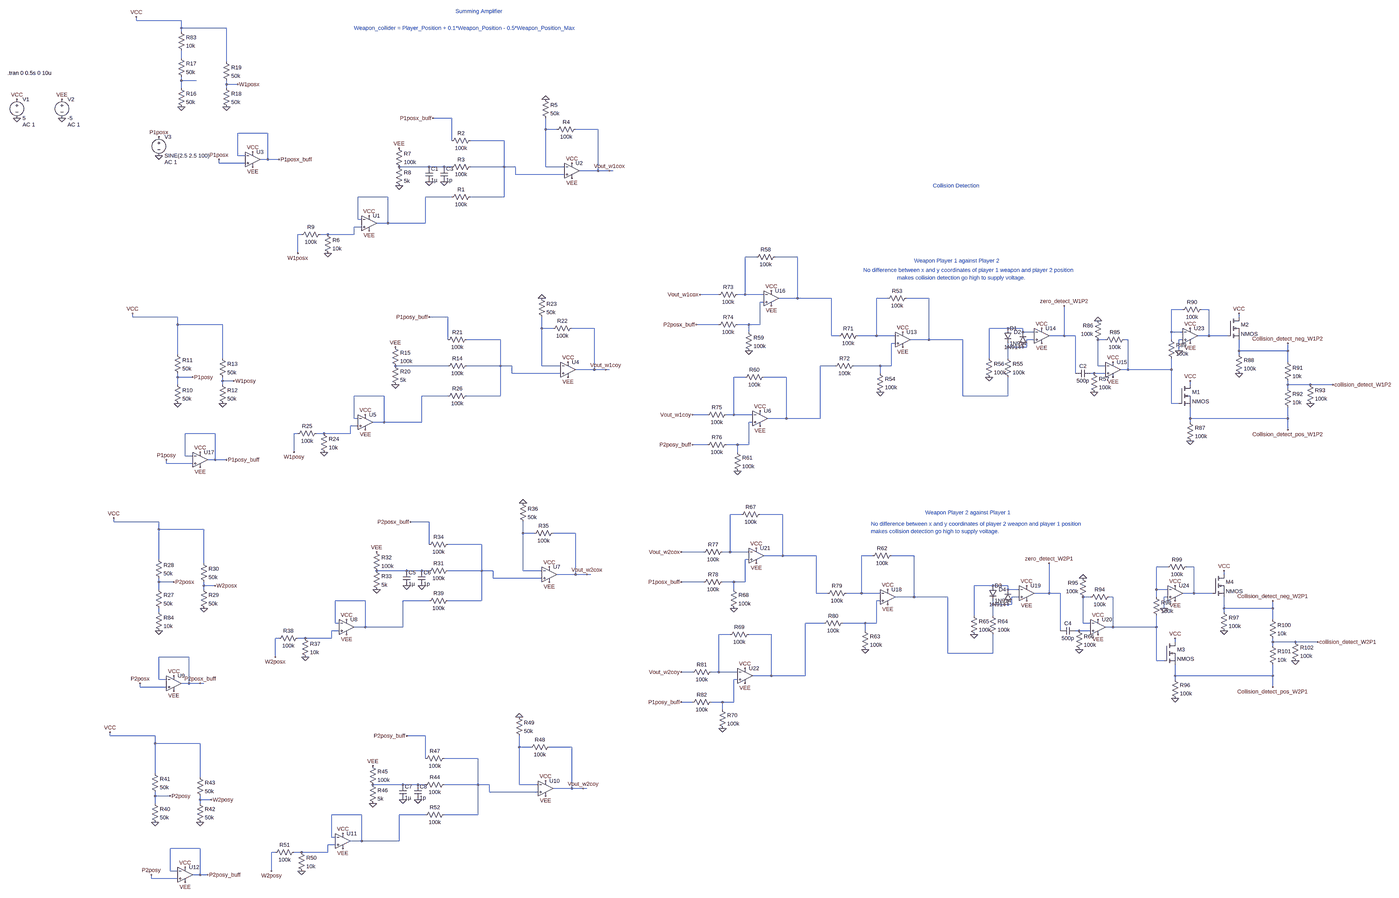
[diagram p0: schematic analog-vg-circuit-stabber.asc, whole sheet]
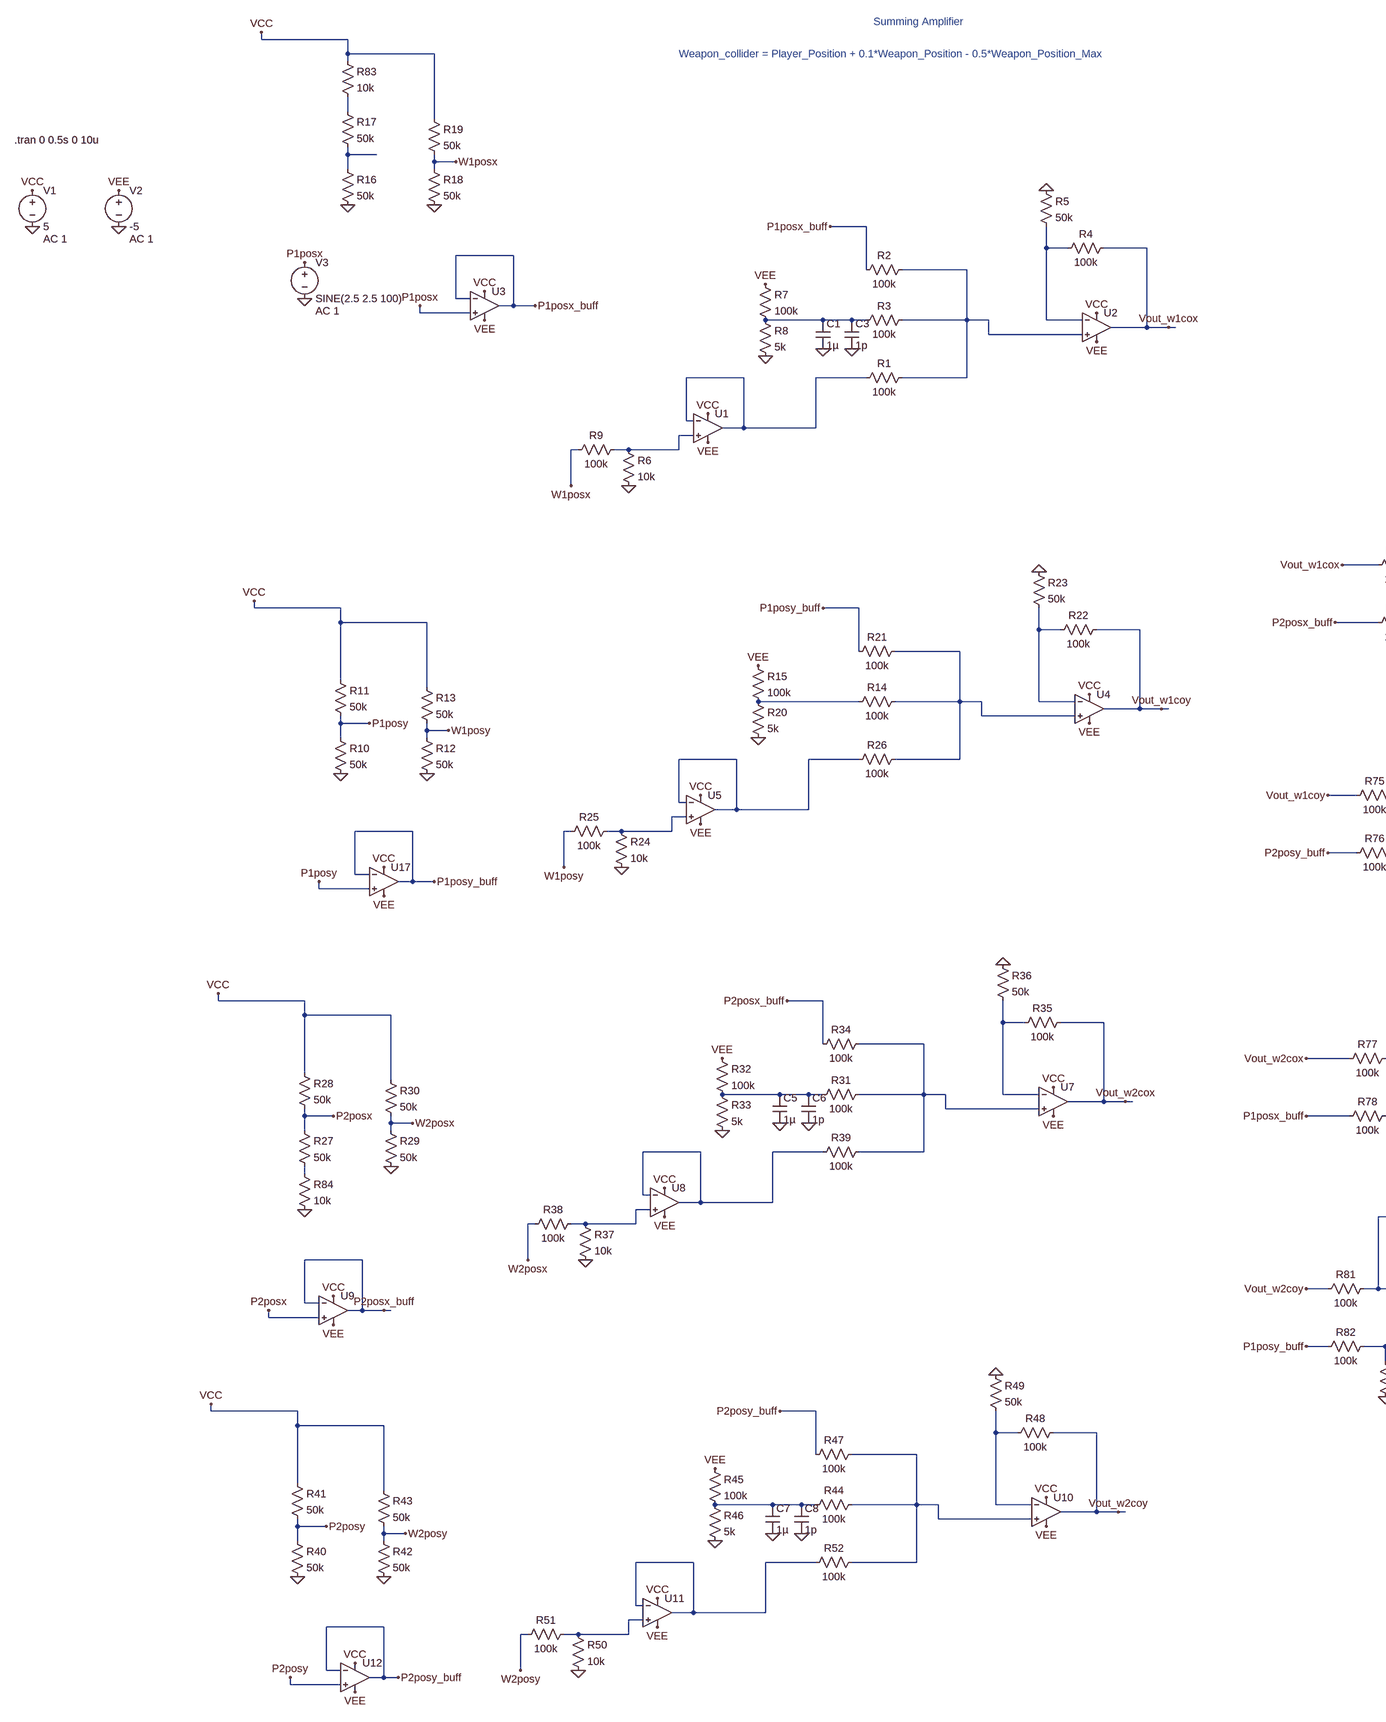
[diagram p1: schematic analog-vg-circuit-stabber.asc, part, row 1 of 1, column 1 of 2]
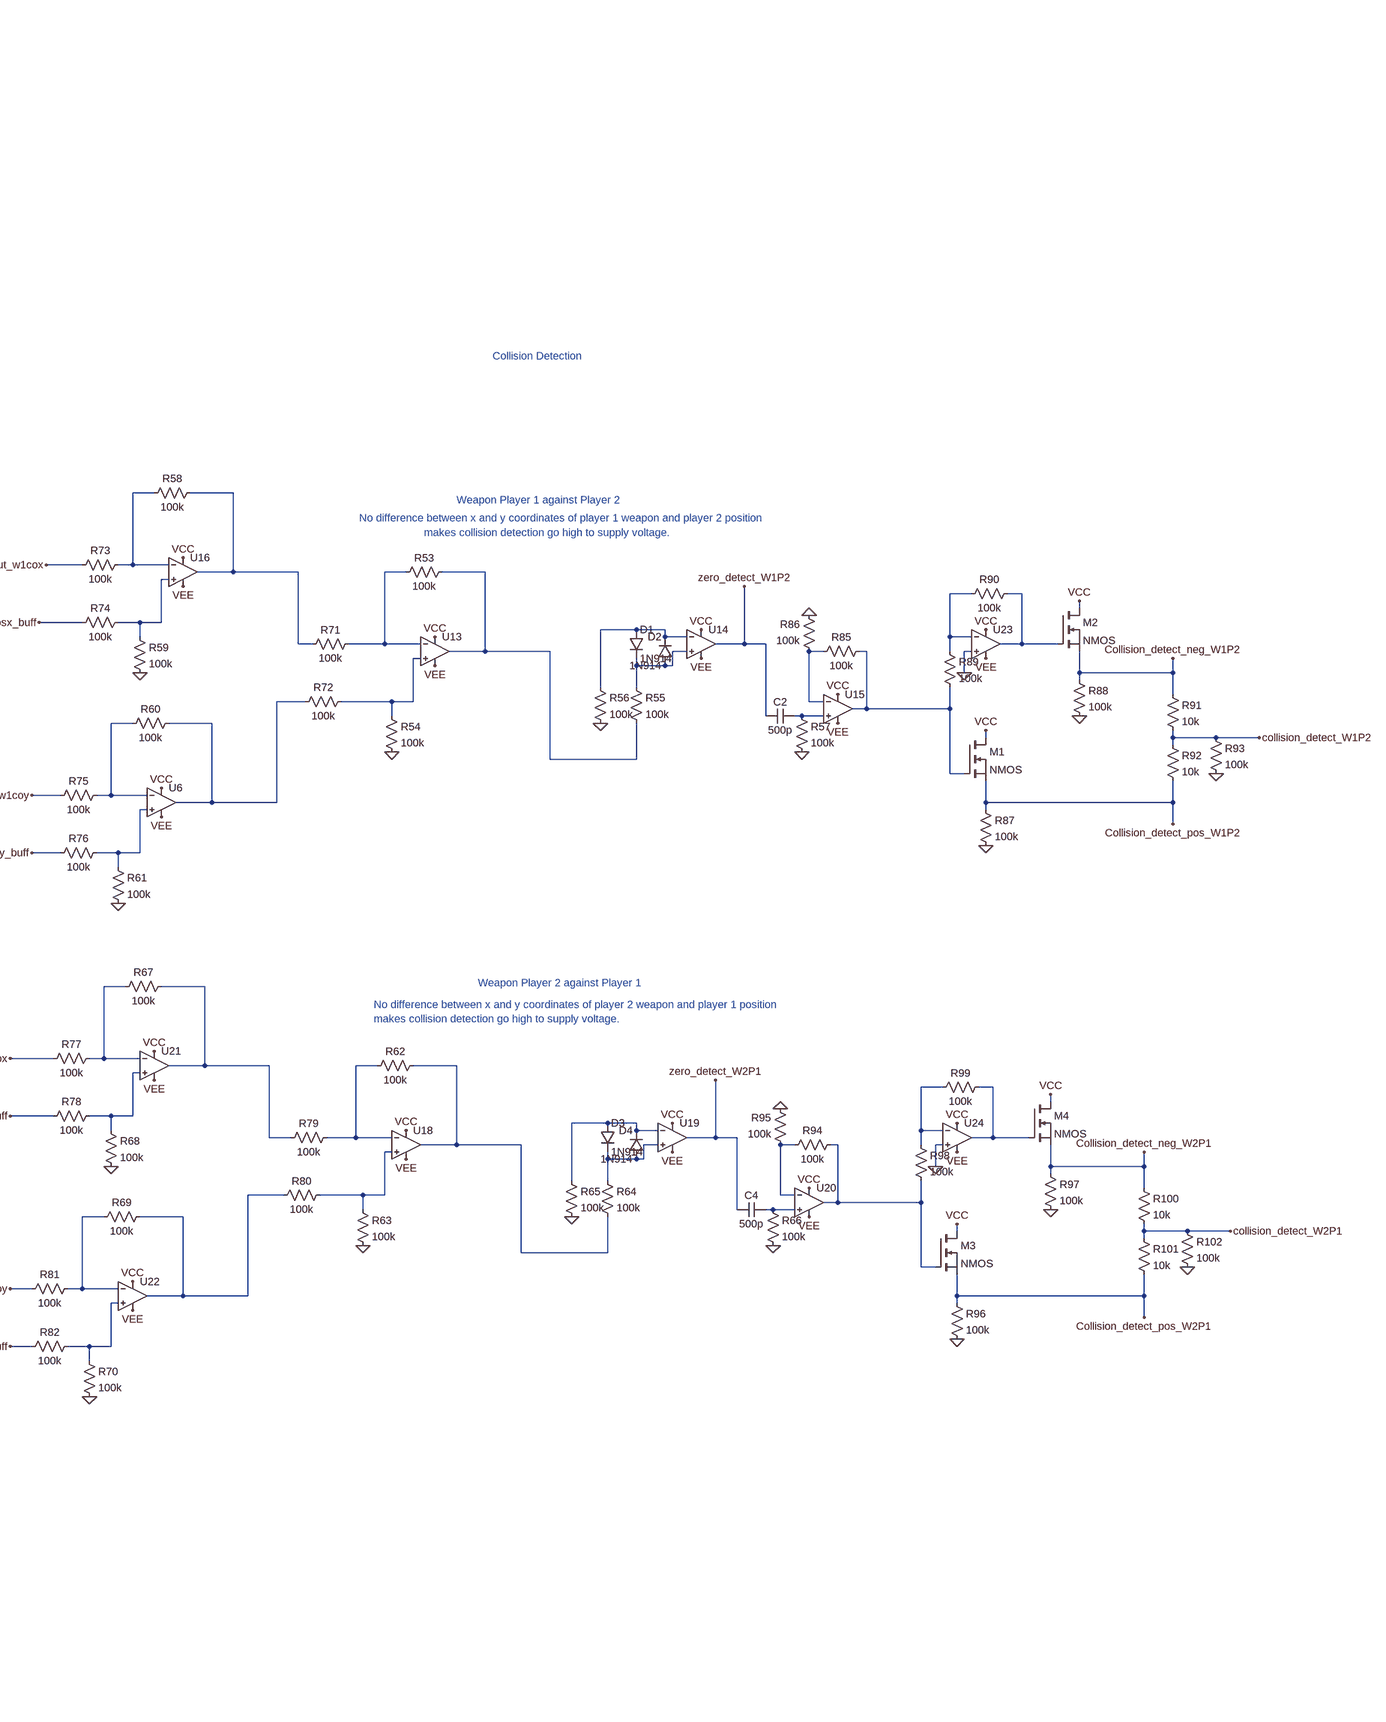
[diagram p2: schematic analog-vg-circuit-stabber.asc, part, row 1 of 1, column 2 of 2]
analog-vg-circuit-stabber.asc, the LTspice schematic file:
Version 4
SHEET 1 8172 3480
WIRE 2144 -336 2144 -352
WIRE 2336 -336 2144 -336
WIRE 2336 -304 2336 -336
WIRE 2528 -304 2336 -304
WIRE 2336 -288 2336 -304
WIRE 2336 -176 2336 -208
WIRE 2528 -160 2528 -304
WIRE 2336 -80 2336 -96
WIRE 2400 -80 2336 -80
WIRE 2528 -64 2528 -80
WIRE 2576 -64 2528 -64
WIRE 2336 -48 2336 -80
WIRE 2528 -48 2528 -64
WIRE 3488 80 3408 80
WIRE 3888 128 3888 80
WIRE 3936 128 3888 128
WIRE 4112 128 4016 128
WIRE 2704 144 2576 144
WIRE 3488 176 3488 80
WIRE 3712 176 3568 176
WIRE 2576 240 2576 144
WIRE 2608 240 2576 240
WIRE 2704 256 2704 144
WIRE 2704 256 2672 256
WIRE 2752 256 2704 256
WIRE 2496 272 2496 256
WIRE 2608 272 2496 272
WIRE 3392 288 3264 288
WIRE 3456 288 3392 288
WIRE 3488 288 3456 288
WIRE 3712 288 3712 176
WIRE 3712 288 3568 288
WIRE 3760 288 3712 288
WIRE 3888 288 3888 128
WIRE 3968 288 3888 288
WIRE 4112 304 4112 128
WIRE 4112 304 4032 304
WIRE 4160 304 4112 304
WIRE 4176 304 4160 304
WIRE 3760 320 3760 288
WIRE 3968 320 3760 320
WIRE 3216 416 3088 416
WIRE 3488 416 3376 416
WIRE 3712 416 3712 288
WIRE 3712 416 3568 416
WIRE 3088 512 3088 416
WIRE 3104 512 3088 512
WIRE 3216 528 3216 416
WIRE 3216 528 3168 528
WIRE 3376 528 3376 416
WIRE 3376 528 3216 528
WIRE 3104 544 3072 544
WIRE 2848 576 2832 576
WIRE 2960 576 2928 576
WIRE 3072 576 3072 544
WIRE 3072 576 2960 576
WIRE 2832 656 2832 576
WIRE 5376 672 5328 672
WIRE 5552 672 5456 672
WIRE 5216 832 5136 832
WIRE 5328 832 5328 672
WIRE 5328 832 5296 832
WIRE 5408 832 5328 832
WIRE 5552 848 5552 672
WIRE 5552 848 5472 848
WIRE 5696 848 5552 848
WIRE 5936 848 5888 848
WIRE 6112 848 6016 848
WIRE 5408 864 5392 864
WIRE 7248 896 7200 896
WIRE 7360 896 7328 896
WIRE 2128 928 2128 912
WIRE 2320 928 2128 928
WIRE 3472 928 3392 928
WIRE 7488 928 7488 912
WIRE 2320 960 2320 928
WIRE 2512 960 2320 960
WIRE 5216 960 5120 960
WIRE 5344 960 5296 960
WIRE 5392 960 5392 864
WIRE 5392 960 5344 960
WIRE 3872 976 3872 928
WIRE 3920 976 3872 976
WIRE 4096 976 4000 976
WIRE 6448 976 6368 976
WIRE 6512 976 6448 976
WIRE 5344 992 5344 960
WIRE 6512 992 6512 976
WIRE 6560 992 6512 992
WIRE 7200 992 7200 896
WIRE 7248 992 7200 992
WIRE 5696 1008 5696 848
WIRE 5728 1008 5696 1008
WIRE 5888 1008 5888 848
WIRE 5888 1008 5808 1008
WIRE 5968 1008 5888 1008
WIRE 6688 1008 6688 880
WIRE 6688 1008 6624 1008
WIRE 6736 1008 6688 1008
WIRE 7360 1008 7360 896
WIRE 7360 1008 7312 1008
WIRE 7440 1008 7360 1008
WIRE 3472 1024 3472 928
WIRE 3696 1024 3552 1024
WIRE 6112 1024 6112 848
WIRE 6112 1024 6032 1024
WIRE 6256 1024 6112 1024
WIRE 6560 1024 6528 1024
WIRE 6864 1024 6832 1024
WIRE 6960 1024 6944 1024
WIRE 7200 1024 7200 992
WIRE 7248 1024 7232 1024
WIRE 5968 1040 5952 1040
WIRE 6448 1056 6448 1040
WIRE 6512 1056 6448 1056
WIRE 6528 1056 6528 1024
WIRE 6528 1056 6512 1056
WIRE 7232 1072 7232 1024
WIRE 7488 1072 7488 1024
WIRE 7696 1072 7696 1040
WIRE 7696 1072 7488 1072
WIRE 2320 1088 2320 960
WIRE 7488 1088 7488 1072
WIRE 2512 1104 2512 960
WIRE 6368 1104 6368 976
WIRE 6448 1104 6448 1056
WIRE 7696 1120 7696 1072
WIRE 3472 1136 3248 1136
WIRE 3696 1136 3696 1024
WIRE 3696 1136 3552 1136
WIRE 3744 1136 3696 1136
WIRE 3872 1136 3872 976
WIRE 3952 1136 3872 1136
WIRE 5712 1136 5648 1136
WIRE 5904 1136 5792 1136
WIRE 5952 1136 5952 1040
WIRE 5952 1136 5904 1136
WIRE 6832 1136 6832 1024
WIRE 6864 1136 6832 1136
WIRE 4096 1152 4096 976
WIRE 4096 1152 4016 1152
WIRE 4144 1152 4096 1152
WIRE 4160 1152 4144 1152
WIRE 6960 1152 6960 1024
WIRE 6960 1152 6928 1152
WIRE 7200 1152 7200 1104
WIRE 7200 1152 6960 1152
WIRE 3744 1168 3744 1136
WIRE 3952 1168 3744 1168
WIRE 5904 1168 5904 1136
WIRE 6736 1168 6736 1008
WIRE 6816 1168 6800 1168
WIRE 6864 1168 6816 1168
WIRE 2320 1184 2320 1168
WIRE 2384 1184 2320 1184
WIRE 5328 1184 5280 1184
WIRE 5504 1184 5408 1184
WIRE 2512 1200 2512 1184
WIRE 2560 1200 2512 1200
WIRE 2320 1216 2320 1184
WIRE 2512 1216 2512 1200
WIRE 7280 1216 7280 1200
WIRE 7696 1216 7696 1200
WIRE 7792 1216 7696 1216
WIRE 7888 1216 7792 1216
WIRE 7696 1232 7696 1216
WIRE 3200 1264 3072 1264
WIRE 3472 1264 3360 1264
WIRE 3696 1264 3696 1136
WIRE 3696 1264 3552 1264
WIRE 6256 1264 6256 1024
WIRE 6448 1264 6448 1184
WIRE 6448 1264 6256 1264
WIRE 7200 1296 7200 1152
WIRE 7232 1296 7200 1296
WIRE 5168 1344 5104 1344
WIRE 5280 1344 5280 1184
WIRE 5280 1344 5248 1344
WIRE 5360 1344 5280 1344
WIRE 3072 1360 3072 1264
WIRE 3088 1360 3072 1360
WIRE 5504 1360 5504 1184
WIRE 5504 1360 5424 1360
WIRE 5648 1360 5648 1136
WIRE 5648 1360 5504 1360
WIRE 7280 1360 7280 1312
WIRE 7696 1360 7696 1312
WIRE 7696 1360 7280 1360
WIRE 3200 1376 3200 1264
WIRE 3200 1376 3152 1376
WIRE 3360 1376 3360 1264
WIRE 3360 1376 3200 1376
WIRE 5360 1376 5344 1376
WIRE 7280 1376 7280 1360
WIRE 3088 1392 3056 1392
WIRE 7696 1408 7696 1360
WIRE 2480 1424 2352 1424
WIRE 2832 1424 2816 1424
WIRE 2944 1424 2912 1424
WIRE 3056 1424 3056 1392
WIRE 3056 1424 2944 1424
WIRE 5168 1472 5104 1472
WIRE 5296 1472 5248 1472
WIRE 5344 1472 5344 1376
WIRE 5344 1472 5296 1472
WIRE 2816 1504 2816 1424
WIRE 5296 1504 5296 1472
WIRE 2352 1520 2352 1424
WIRE 2384 1520 2352 1520
WIRE 2480 1536 2480 1424
WIRE 2480 1536 2448 1536
WIRE 2528 1536 2480 1536
WIRE 2272 1552 2272 1536
WIRE 2384 1552 2272 1552
WIRE 5312 1824 5264 1824
WIRE 5488 1824 5392 1824
WIRE 2048 1856 2048 1840
WIRE 2240 1856 2048 1856
WIRE 3392 1856 3312 1856
WIRE 2240 1888 2240 1856
WIRE 2432 1888 2240 1888
WIRE 3792 1904 3792 1856
WIRE 3840 1904 3792 1904
WIRE 4016 1904 3920 1904
WIRE 3392 1952 3392 1856
WIRE 3616 1952 3472 1952
WIRE 5152 1984 5056 1984
WIRE 5264 1984 5264 1824
WIRE 5264 1984 5232 1984
WIRE 5344 1984 5264 1984
WIRE 5488 2000 5488 1824
WIRE 5488 2000 5408 2000
WIRE 5632 2000 5488 2000
WIRE 5872 2000 5824 2000
WIRE 6048 2000 5952 2000
WIRE 2240 2016 2240 1888
WIRE 5344 2016 5328 2016
WIRE 2432 2032 2432 1888
WIRE 7184 2048 7136 2048
WIRE 7296 2048 7264 2048
WIRE 3296 2064 3168 2064
WIRE 3360 2064 3296 2064
WIRE 3392 2064 3360 2064
WIRE 3616 2064 3616 1952
WIRE 3616 2064 3472 2064
WIRE 3664 2064 3616 2064
WIRE 3792 2064 3792 1904
WIRE 3872 2064 3792 2064
WIRE 4016 2080 4016 1904
WIRE 4016 2080 3936 2080
WIRE 4064 2080 4016 2080
WIRE 4080 2080 4064 2080
WIRE 7424 2080 7424 2064
WIRE 3664 2096 3664 2064
WIRE 3872 2096 3664 2096
WIRE 2240 2112 2240 2096
WIRE 2304 2112 2240 2112
WIRE 5152 2112 5056 2112
WIRE 5280 2112 5232 2112
WIRE 5328 2112 5328 2016
WIRE 5328 2112 5280 2112
WIRE 2432 2128 2432 2112
WIRE 2480 2128 2432 2128
WIRE 6384 2128 6304 2128
WIRE 6448 2128 6384 2128
WIRE 2240 2144 2240 2112
WIRE 2432 2144 2432 2128
WIRE 5280 2144 5280 2112
WIRE 6448 2144 6448 2128
WIRE 6496 2144 6448 2144
WIRE 7136 2144 7136 2048
WIRE 7184 2144 7136 2144
WIRE 5632 2160 5632 2000
WIRE 5680 2160 5632 2160
WIRE 5824 2160 5824 2000
WIRE 5824 2160 5760 2160
WIRE 5904 2160 5824 2160
WIRE 6624 2160 6624 2032
WIRE 6624 2160 6560 2160
WIRE 6672 2160 6624 2160
WIRE 7296 2160 7296 2048
WIRE 7296 2160 7248 2160
WIRE 7376 2160 7296 2160
WIRE 6048 2176 6048 2000
WIRE 6048 2176 5968 2176
WIRE 6192 2176 6048 2176
WIRE 6496 2176 6464 2176
WIRE 6800 2176 6768 2176
WIRE 6896 2176 6880 2176
WIRE 7136 2176 7136 2144
WIRE 7184 2176 7168 2176
WIRE 3120 2192 2992 2192
WIRE 3392 2192 3280 2192
WIRE 3616 2192 3616 2064
WIRE 3616 2192 3472 2192
WIRE 5904 2192 5888 2192
WIRE 6384 2208 6384 2192
WIRE 6448 2208 6384 2208
WIRE 6464 2208 6464 2176
WIRE 6464 2208 6448 2208
WIRE 7168 2224 7168 2176
WIRE 7424 2224 7424 2176
WIRE 7632 2224 7632 2192
WIRE 7632 2224 7424 2224
WIRE 2240 2240 2240 2224
WIRE 7424 2240 7424 2224
WIRE 6304 2256 6304 2128
WIRE 6384 2256 6384 2208
WIRE 7632 2272 7632 2224
WIRE 2992 2288 2992 2192
WIRE 3008 2288 2992 2288
WIRE 5664 2288 5584 2288
WIRE 5840 2288 5744 2288
WIRE 5888 2288 5888 2192
WIRE 5888 2288 5840 2288
WIRE 6768 2288 6768 2176
WIRE 6800 2288 6768 2288
WIRE 3120 2304 3120 2192
WIRE 3120 2304 3072 2304
WIRE 3280 2304 3280 2192
WIRE 3280 2304 3120 2304
WIRE 6896 2304 6896 2176
WIRE 6896 2304 6864 2304
WIRE 7136 2304 7136 2256
WIRE 7136 2304 6896 2304
WIRE 3008 2320 2976 2320
WIRE 5840 2320 5840 2288
WIRE 6672 2320 6672 2160
WIRE 6752 2320 6736 2320
WIRE 6800 2320 6752 2320
WIRE 5264 2336 5216 2336
WIRE 5440 2336 5344 2336
WIRE 2752 2352 2736 2352
WIRE 2864 2352 2832 2352
WIRE 2976 2352 2976 2320
WIRE 2976 2352 2864 2352
WIRE 7216 2368 7216 2352
WIRE 7632 2368 7632 2352
WIRE 7728 2368 7632 2368
WIRE 7824 2368 7728 2368
WIRE 7632 2384 7632 2368
WIRE 6192 2416 6192 2176
WIRE 6384 2416 6384 2336
WIRE 6384 2416 6192 2416
WIRE 2368 2432 2240 2432
WIRE 2736 2432 2736 2352
WIRE 7136 2448 7136 2304
WIRE 7168 2448 7136 2448
WIRE 5104 2496 5056 2496
WIRE 5216 2496 5216 2336
WIRE 5216 2496 5184 2496
WIRE 5296 2496 5216 2496
WIRE 5440 2512 5440 2336
WIRE 5440 2512 5360 2512
WIRE 5584 2512 5584 2288
WIRE 5584 2512 5440 2512
WIRE 7216 2512 7216 2464
WIRE 7632 2512 7632 2464
WIRE 7632 2512 7216 2512
WIRE 2240 2528 2240 2432
WIRE 2272 2528 2240 2528
WIRE 5296 2528 5280 2528
WIRE 7216 2528 7216 2512
WIRE 2368 2544 2368 2432
WIRE 2368 2544 2336 2544
WIRE 2416 2544 2368 2544
WIRE 2432 2544 2416 2544
WIRE 2160 2560 2160 2544
WIRE 2272 2560 2160 2560
WIRE 7632 2560 7632 2512
WIRE 5104 2624 5056 2624
WIRE 5232 2624 5184 2624
WIRE 5280 2624 5280 2528
WIRE 5280 2624 5232 2624
WIRE 5232 2656 5232 2624
WIRE 2032 2768 2032 2752
WIRE 2224 2768 2032 2768
WIRE 3376 2768 3296 2768
WIRE 2224 2800 2224 2768
WIRE 2416 2800 2224 2800
WIRE 3776 2816 3776 2768
WIRE 3824 2816 3776 2816
WIRE 4000 2816 3904 2816
WIRE 3376 2864 3376 2768
WIRE 3600 2864 3456 2864
WIRE 2224 2928 2224 2800
WIRE 2416 2944 2416 2800
WIRE 3280 2976 3152 2976
WIRE 3344 2976 3280 2976
WIRE 3376 2976 3344 2976
WIRE 3600 2976 3600 2864
WIRE 3600 2976 3456 2976
WIRE 3648 2976 3600 2976
WIRE 3776 2976 3776 2816
WIRE 3856 2976 3776 2976
WIRE 4000 2992 4000 2816
WIRE 4000 2992 3920 2992
WIRE 4048 2992 4000 2992
WIRE 4064 2992 4048 2992
WIRE 3648 3008 3648 2976
WIRE 3856 3008 3648 3008
WIRE 2224 3024 2224 3008
WIRE 2288 3024 2224 3024
WIRE 2416 3040 2416 3024
WIRE 2464 3040 2416 3040
WIRE 2224 3056 2224 3024
WIRE 2416 3056 2416 3040
WIRE 3104 3104 2976 3104
WIRE 3376 3104 3264 3104
WIRE 3600 3104 3600 2976
WIRE 3600 3104 3456 3104
WIRE 2976 3200 2976 3104
WIRE 2992 3200 2976 3200
WIRE 3104 3216 3104 3104
WIRE 3104 3216 3056 3216
WIRE 3264 3216 3264 3104
WIRE 3264 3216 3104 3216
WIRE 2992 3232 2960 3232
WIRE 2416 3248 2288 3248
WIRE 2736 3264 2720 3264
WIRE 2848 3264 2816 3264
WIRE 2960 3264 2960 3232
WIRE 2960 3264 2848 3264
WIRE 2288 3344 2288 3248
WIRE 2320 3344 2288 3344
WIRE 2720 3344 2720 3264
WIRE 2416 3360 2416 3248
WIRE 2416 3360 2384 3360
WIRE 2448 3360 2416 3360
WIRE 2208 3376 2208 3360
WIRE 2320 3376 2208 3376
FLAG 4000 272 VCC
FLAG 4000 336 VEE
FLAG 1792 80 0
FLAG 1600 0 VCC
FLAG 2336 32 0
FLAG 2240 160 P1posx
FLAG 2528 32 0
FLAG 2576 -64 W1posx
FLAG 2144 -352 VCC
FLAG 1600 80 0
FLAG 1792 0 VEE
FLAG 4160 304 Vout_w1cox
FLAG 3136 496 VCC
FLAG 3136 560 VEE
FLAG 3264 208 VEE
FLAG 3264 368 0
FLAG 2496 256 P1posx
FLAG 3888 0 0
FLAG 2640 224 VCC
FLAG 2640 288 VEE
FLAG 3392 352 0
FLAG 2960 656 0
FLAG 3456 352 0
FLAG 2832 656 W1posx
FLAG 2320 1296 0
FLAG 2384 1184 P1posy
FLAG 2512 1296 0
FLAG 2560 1200 W1posy
FLAG 2128 912 VCC
FLAG 3984 1120 VCC
FLAG 3984 1184 VEE
FLAG 4144 1152 Vout_w1coy
FLAG 3120 1344 VCC
FLAG 3120 1408 VEE
FLAG 3248 1056 VEE
FLAG 3248 1216 0
FLAG 3872 848 0
FLAG 2944 1504 0
FLAG 2816 1504 W1posy
FLAG 2304 2112 P2posx
FLAG 2432 2224 0
FLAG 2480 2128 W2posx
FLAG 2048 1840 VCC
FLAG 3904 2048 VCC
FLAG 3904 2112 VEE
FLAG 4064 2080 Vout_w2cox
FLAG 3040 2272 VCC
FLAG 3040 2336 VEE
FLAG 3168 1984 VEE
FLAG 3168 2144 0
FLAG 2160 2544 P2posx
FLAG 3792 1776 0
FLAG 2304 2512 VCC
FLAG 2304 2576 VEE
FLAG 3296 2128 0
FLAG 2864 2432 0
FLAG 3360 2128 0
FLAG 2736 2432 W2posx
FLAG 2224 3136 0
FLAG 2288 3024 P2posy
FLAG 2416 3136 0
FLAG 2464 3040 W2posy
FLAG 2032 2752 VCC
FLAG 3888 2960 VCC
FLAG 3888 3024 VEE
FLAG 4048 2992 Vout_w2coy
FLAG 3024 3184 VCC
FLAG 3024 3248 VEE
FLAG 3152 2896 VEE
FLAG 3152 3056 0
FLAG 2208 3360 P2posy
FLAG 3776 2688 0
FLAG 2352 3328 VCC
FLAG 2352 3392 VEE
FLAG 3280 3040 0
FLAG 2848 3344 0
FLAG 3344 3040 0
FLAG 2720 3344 W2posy
FLAG 6000 992 VCC
FLAG 6000 1056 VEE
FLAG 5904 1248 0
FLAG 5440 816 VCC
FLAG 5440 880 VEE
FLAG 5344 1072 0
FLAG 5136 832 Vout_w1cox
FLAG 2752 256 P1posx_buff
FLAG 3408 80 P1posx_buff
FLAG 2272 1536 P1posy
FLAG 2416 1504 VCC
FLAG 2416 1568 VEE
FLAG 2528 1536 P1posy_buff
FLAG 3392 928 P1posy_buff
FLAG 2416 2544 P2posx_buff
FLAG 3312 1856 P2posx_buff
FLAG 2448 3360 P2posy_buff
FLAG 3296 2768 P2posy_buff
FLAG 5120 960 P2posx_buff
FLAG 5392 1328 VCC
FLAG 5392 1392 VEE
FLAG 5296 1584 0
FLAG 5104 1344 Vout_w1coy
FLAG 5104 1472 P2posy_buff
FLAG 5936 2144 VCC
FLAG 5936 2208 VEE
FLAG 5840 2400 0
FLAG 5376 1968 VCC
FLAG 5376 2032 VEE
FLAG 5280 2224 0
FLAG 5056 1984 Vout_w2cox
FLAG 5056 2112 P1posx_buff
FLAG 5328 2480 VCC
FLAG 5328 2544 VEE
FLAG 5232 2736 0
FLAG 5056 2496 Vout_w2coy
FLAG 5056 2624 P1posy_buff
FLAG 2240 2320 0
FLAG 6368 1184 0
FLAG 6592 976 VCC
FLAG 6688 880 zero_detect_W1P2
FLAG 6592 1040 VEE
FLAG 6896 1120 VCC
FLAG 6896 1184 VEE
FLAG 6816 1248 0
FLAG 6832 944 0
FLAG 7280 1200 VCC
FLAG 7280 1456 0
FLAG 7696 1408 Collision_detect_pos_W1P2
FLAG 7488 912 VCC
FLAG 7488 1168 0
FLAG 7696 1040 Collision_detect_neg_W1P2
FLAG 7232 1072 0
FLAG 7280 976 VCC
FLAG 7280 1040 VEE
FLAG 7792 1296 0
FLAG 7888 1216 collision_detect_W1P2
FLAG 6304 2336 0
FLAG 6528 2128 VCC
FLAG 6624 2032 zero_detect_W2P1
FLAG 6528 2192 VEE
FLAG 6832 2272 VCC
FLAG 6832 2336 VEE
FLAG 6752 2400 0
FLAG 6768 2096 0
FLAG 7216 2352 VCC
FLAG 7216 2608 0
FLAG 7632 2560 Collision_detect_pos_W2P1
FLAG 7424 2064 VCC
FLAG 7424 2320 0
FLAG 7632 2192 Collision_detect_neg_W2P1
FLAG 7168 2224 0
FLAG 7216 2128 VCC
FLAG 7216 2192 VEE
FLAG 7728 2448 0
FLAG 7824 2368 collision_detect_W2P1
FLAG 2240 240 0
SYMBOL res 3584 272 R90
WINDOW 0 0 56 VBottom 2
WINDOW 3 32 56 VTop 2
SYMATTR InstName R3
SYMATTR Value 100k
SYMBOL Opamps\\UniversalOpamp2 4000 304 R0
SYMATTR InstName U2
SYMBOL voltage 1792 -16 R0
WINDOW 123 24 124 Left 2
WINDOW 39 0 0 Left 2
SYMATTR Value2 AC 1
SYMATTR InstName V2
SYMATTR Value -5
SYMBOL res 2320 -64 R0
SYMATTR InstName R16
SYMATTR Value 50k
SYMBOL res 2320 -192 R0
SYMATTR InstName R17
SYMATTR Value 50k
SYMBOL res 2512 -64 R0
SYMATTR InstName R18
SYMATTR Value 50k
SYMBOL res 2512 -176 R0
SYMATTR InstName R19
SYMATTR Value 50k
SYMBOL voltage 1600 -16 R0
WINDOW 123 24 124 Left 2
WINDOW 39 0 0 Left 2
SYMATTR Value2 AC 1
SYMATTR InstName V1
SYMATTR Value 5
SYMBOL Opamps\\UniversalOpamp2 3136 528 R0
SYMATTR InstName U1
SYMBOL res 3248 192 R0
SYMATTR InstName R7
SYMATTR Value 100k
SYMBOL res 3248 272 R0
SYMATTR InstName R8
SYMATTR Value 5k
SYMBOL res 3584 160 R90
WINDOW 0 0 56 VBottom 2
WINDOW 3 32 56 VTop 2
SYMATTR InstName R2
SYMATTR Value 100k
SYMBOL res 4032 112 R90
WINDOW 0 0 56 VBottom 2
WINDOW 3 32 56 VTop 2
SYMATTR InstName R4
SYMATTR Value 100k
SYMBOL res 3872 -16 R0
SYMATTR InstName R5
SYMATTR Value 50k
SYMBOL Opamps\\UniversalOpamp2 2640 256 R0
SYMATTR InstName U3
SYMBOL cap 3376 288 R0
SYMATTR InstName C1
SYMATTR Value 1µ
SYMBOL res 2944 560 R0
SYMATTR InstName R6
SYMATTR Value 10k
SYMBOL res 2944 560 R90
WINDOW 0 0 56 VBottom 2
WINDOW 3 32 56 VTop 2
SYMATTR InstName R9
SYMATTR Value 100k
SYMBOL cap 3440 288 R0
SYMATTR InstName C3
SYMATTR Value 1p
SYMBOL res 3584 400 R90
WINDOW 0 0 56 VBottom 2
WINDOW 3 32 56 VTop 2
SYMATTR InstName R1
SYMATTR Value 100k
SYMBOL res 2304 1200 R0
SYMATTR InstName R10
SYMATTR Value 50k
SYMBOL res 2304 1072 R0
SYMATTR InstName R11
SYMATTR Value 50k
SYMBOL res 2496 1200 R0
SYMATTR InstName R12
SYMATTR Value 50k
SYMBOL res 2496 1088 R0
SYMATTR InstName R13
SYMATTR Value 50k
SYMBOL res 3568 1120 R90
WINDOW 0 0 56 VBottom 2
WINDOW 3 32 56 VTop 2
SYMATTR InstName R14
SYMATTR Value 100k
SYMBOL Opamps\\UniversalOpamp2 3984 1152 R0
SYMATTR InstName U4
SYMBOL Opamps\\UniversalOpamp2 3120 1376 R0
SYMATTR InstName U5
SYMBOL res 3232 1040 R0
SYMATTR InstName R15
SYMATTR Value 100k
SYMBOL res 3232 1120 R0
SYMATTR InstName R20
SYMATTR Value 5k
SYMBOL res 3568 1008 R90
WINDOW 0 0 56 VBottom 2
WINDOW 3 32 56 VTop 2
SYMATTR InstName R21
SYMATTR Value 100k
SYMBOL res 4016 960 R90
WINDOW 0 0 56 VBottom 2
WINDOW 3 32 56 VTop 2
SYMATTR InstName R22
SYMATTR Value 100k
SYMBOL res 3856 832 R0
SYMATTR InstName R23
SYMATTR Value 50k
SYMBOL res 2928 1408 R0
SYMATTR InstName R24
SYMATTR Value 10k
SYMBOL res 2928 1408 R90
WINDOW 0 0 56 VBottom 2
WINDOW 3 32 56 VTop 2
SYMATTR InstName R25
SYMATTR Value 100k
SYMBOL res 3568 1248 R90
WINDOW 0 0 56 VBottom 2
WINDOW 3 32 56 VTop 2
SYMATTR InstName R26
SYMATTR Value 100k
SYMBOL res 2224 2128 R0
SYMATTR InstName R27
SYMATTR Value 50k
SYMBOL res 2224 2000 R0
SYMATTR InstName R28
SYMATTR Value 50k
SYMBOL res 2416 2128 R0
SYMATTR InstName R29
SYMATTR Value 50k
SYMBOL res 2416 2016 R0
SYMATTR InstName R30
SYMATTR Value 50k
SYMBOL res 3488 2048 R90
WINDOW 0 0 56 VBottom 2
WINDOW 3 32 56 VTop 2
SYMATTR InstName R31
SYMATTR Value 100k
SYMBOL Opamps\\UniversalOpamp2 3904 2080 R0
SYMATTR InstName U7
SYMBOL Opamps\\UniversalOpamp2 3040 2304 R0
SYMATTR InstName U8
SYMBOL res 3152 1968 R0
SYMATTR InstName R32
SYMATTR Value 100k
SYMBOL res 3152 2048 R0
SYMATTR InstName R33
SYMATTR Value 5k
SYMBOL res 3488 1936 R90
WINDOW 0 0 56 VBottom 2
WINDOW 3 32 56 VTop 2
SYMATTR InstName R34
SYMATTR Value 100k
SYMBOL res 3936 1888 R90
WINDOW 0 0 56 VBottom 2
WINDOW 3 32 56 VTop 2
SYMATTR InstName R35
SYMATTR Value 100k
SYMBOL res 3776 1760 R0
SYMATTR InstName R36
SYMATTR Value 50k
SYMBOL Opamps\\UniversalOpamp2 2304 2544 R0
SYMATTR InstName U9
SYMBOL cap 3280 2064 R0
SYMATTR InstName C5
SYMATTR Value 1µ
SYMBOL res 2848 2336 R0
SYMATTR InstName R37
SYMATTR Value 10k
SYMBOL res 2848 2336 R90
WINDOW 0 0 56 VBottom 2
WINDOW 3 32 56 VTop 2
SYMATTR InstName R38
SYMATTR Value 100k
SYMBOL cap 3344 2064 R0
SYMATTR InstName C6
SYMATTR Value 1p
SYMBOL res 3488 2176 R90
WINDOW 0 0 56 VBottom 2
WINDOW 3 32 56 VTop 2
SYMATTR InstName R39
SYMATTR Value 100k
SYMBOL res 2208 3040 R0
SYMATTR InstName R40
SYMATTR Value 50k
SYMBOL res 2208 2912 R0
SYMATTR InstName R41
SYMATTR Value 50k
SYMBOL res 2400 3040 R0
SYMATTR InstName R42
SYMATTR Value 50k
SYMBOL res 2400 2928 R0
SYMATTR InstName R43
SYMATTR Value 50k
SYMBOL res 3472 2960 R90
WINDOW 0 0 56 VBottom 2
WINDOW 3 32 56 VTop 2
SYMATTR InstName R44
SYMATTR Value 100k
SYMBOL Opamps\\UniversalOpamp2 3888 2992 R0
SYMATTR InstName U10
SYMBOL Opamps\\UniversalOpamp2 3024 3216 R0
SYMATTR InstName U11
SYMBOL res 3136 2880 R0
SYMATTR InstName R45
SYMATTR Value 100k
SYMBOL res 3136 2960 R0
SYMATTR InstName R46
SYMATTR Value 5k
SYMBOL res 3472 2848 R90
WINDOW 0 0 56 VBottom 2
WINDOW 3 32 56 VTop 2
SYMATTR InstName R47
SYMATTR Value 100k
SYMBOL res 3920 2800 R90
WINDOW 0 0 56 VBottom 2
WINDOW 3 32 56 VTop 2
SYMATTR InstName R48
SYMATTR Value 100k
SYMBOL res 3760 2672 R0
SYMATTR InstName R49
SYMATTR Value 50k
SYMBOL Opamps\\UniversalOpamp2 2352 3360 R0
SYMATTR InstName U12
SYMBOL cap 3264 2976 R0
SYMATTR InstName C7
SYMATTR Value 1µ
SYMBOL res 2832 3248 R0
SYMATTR InstName R50
SYMATTR Value 10k
SYMBOL res 2832 3248 R90
WINDOW 0 0 56 VBottom 2
WINDOW 3 32 56 VTop 2
SYMATTR InstName R51
SYMATTR Value 100k
SYMBOL cap 3328 2976 R0
SYMATTR InstName C8
SYMATTR Value 1p
SYMBOL res 3472 3088 R90
WINDOW 0 0 56 VBottom 2
WINDOW 3 32 56 VTop 2
SYMATTR InstName R52
SYMATTR Value 100k
SYMBOL Opamps\\UniversalOpamp2 6000 1024 R0
SYMATTR InstName U13
SYMBOL res 6032 832 R90
WINDOW 0 0 56 VBottom 2
WINDOW 3 32 56 VTop 2
SYMATTR InstName R53
SYMATTR Value 100k
SYMBOL res 5888 1152 R0
SYMATTR InstName R54
SYMATTR Value 100k
SYMBOL Opamps\\UniversalOpamp2 5440 848 R0
SYMATTR InstName U16
SYMBOL res 5472 656 R90
WINDOW 0 0 56 VBottom 2
WINDOW 3 32 56 VTop 2
SYMATTR InstName R58
SYMATTR Value 100k
SYMBOL res 5328 976 R0
SYMATTR InstName R59
SYMATTR Value 100k
SYMBOL Opamps\\UniversalOpamp2 2416 1536 R0
SYMATTR InstName U17
SYMBOL Opamps\\UniversalOpamp2 5392 1360 R0
SYMATTR InstName U6
SYMBOL res 5424 1168 R90
WINDOW 0 0 56 VBottom 2
WINDOW 3 32 56 VTop 2
SYMATTR InstName R60
SYMATTR Value 100k
SYMBOL res 5280 1488 R0
SYMATTR InstName R61
SYMATTR Value 100k
SYMBOL Opamps\\UniversalOpamp2 5936 2176 R0
SYMATTR InstName U18
SYMBOL res 5968 1984 R90
WINDOW 0 0 56 VBottom 2
WINDOW 3 32 56 VTop 2
SYMATTR InstName R62
SYMATTR Value 100k
SYMBOL res 5824 2304 R0
SYMATTR InstName R63
SYMATTR Value 100k
SYMBOL Opamps\\UniversalOpamp2 5376 2000 R0
SYMATTR InstName U21
SYMBOL res 5408 1808 R90
WINDOW 0 0 56 VBottom 2
WINDOW 3 32 56 VTop 2
SYMATTR InstName R67
SYMATTR Value 100k
SYMBOL res 5264 2128 R0
SYMATTR InstName R68
SYMATTR Value 100k
SYMBOL Opamps\\UniversalOpamp2 5328 2512 R0
SYMATTR InstName U22
SYMBOL res 5360 2320 R90
WINDOW 0 0 56 VBottom 2
WINDOW 3 32 56 VTop 2
SYMATTR InstName R69
SYMATTR Value 100k
SYMBOL res 5216 2640 R0
SYMATTR InstName R70
SYMATTR Value 100k
SYMBOL res 5824 992 R90
WINDOW 0 0 56 VBottom 2
WINDOW 3 32 56 VTop 2
SYMATTR InstName R71
SYMATTR Value 100k
SYMBOL res 5808 1120 R90
WINDOW 0 0 56 VBottom 2
WINDOW 3 32 56 VTop 2
SYMATTR InstName R72
SYMATTR Value 100k
SYMBOL res 5312 816 R90
WINDOW 0 0 56 VBottom 2
WINDOW 3 32 56 VTop 2
SYMATTR InstName R73
SYMATTR Value 100k
SYMBOL res 5312 944 R90
WINDOW 0 0 56 VBottom 2
WINDOW 3 32 56 VTop 2
SYMATTR InstName R74
SYMATTR Value 100k
SYMBOL res 5264 1328 R90
WINDOW 0 0 56 VBottom 2
WINDOW 3 32 56 VTop 2
SYMATTR InstName R75
SYMATTR Value 100k
SYMBOL res 5264 1456 R90
WINDOW 0 0 56 VBottom 2
WINDOW 3 32 56 VTop 2
SYMATTR InstName R76
SYMATTR Value 100k
SYMBOL res 5248 1968 R90
WINDOW 0 0 56 VBottom 2
WINDOW 3 32 56 VTop 2
SYMATTR InstName R77
SYMATTR Value 100k
SYMBOL res 5248 2096 R90
WINDOW 0 0 56 VBottom 2
WINDOW 3 32 56 VTop 2
SYMATTR InstName R78
SYMATTR Value 100k
SYMBOL res 5776 2144 R90
WINDOW 0 0 56 VBottom 2
WINDOW 3 32 56 VTop 2
SYMATTR InstName R79
SYMATTR Value 100k
SYMBOL res 5760 2272 R90
WINDOW 0 0 56 VBottom 2
WINDOW 3 32 56 VTop 2
SYMATTR InstName R80
SYMATTR Value 100k
SYMBOL res 5200 2480 R90
WINDOW 0 0 56 VBottom 2
WINDOW 3 32 56 VTop 2
SYMATTR InstName R81
SYMATTR Value 100k
SYMBOL res 5200 2608 R90
WINDOW 0 0 56 VBottom 2
WINDOW 3 32 56 VTop 2
SYMATTR InstName R82
SYMATTR Value 100k
SYMBOL res 2320 -304 R0
SYMATTR InstName R83
SYMATTR Value 10k
SYMBOL res 2224 2224 R0
SYMATTR InstName R84
SYMATTR Value 10k
SYMBOL Opamps\\UniversalOpamp2 6592 1008 R0
SYMATTR InstName U14
SYMBOL res 6432 1088 R0
SYMATTR InstName R55
SYMATTR Value 100k
SYMBOL res 6352 1088 R0
SYMATTR InstName R56
SYMATTR Value 100k
SYMBOL diode 6432 976 R0
SYMATTR InstName D1
SYMATTR Value 1N914
SYMBOL diode 6528 1056 R180
WINDOW 0 24 64 Left 2
WINDOW 3 24 0 Left 2
SYMATTR InstName D2
SYMATTR Value 1N914
SYMBOL Opamps\\UniversalOpamp2 6896 1152 R0
SYMATTR InstName U15
SYMBOL cap 6800 1152 R90
WINDOW 0 0 32 VBottom 2
WINDOW 3 32 32 VTop 2
SYMATTR InstName C2
SYMATTR Value 500p
SYMBOL res 6800 1152 R0
SYMATTR InstName R57
SYMATTR Value 100k
SYMBOL res 6960 1008 R90
WINDOW 0 0 56 VBottom 2
WINDOW 3 32 56 VTop 2
SYMATTR InstName R85
SYMATTR Value 100k
SYMBOL res 6848 1040 R180
WINDOW 0 36 76 Left 2
WINDOW 3 36 40 Left 2
SYMATTR InstName R86
SYMATTR Value 100k
SYMBOL nmos 7232 1216 R0
SYMATTR InstName M1
SYMBOL res 7264 1360 R0
SYMATTR InstName R87
SYMATTR Value 100k
SYMBOL Opamps\\UniversalOpamp2 7280 1008 R0
SYMATTR InstName U23
SYMBOL res 7472 1072 R0
SYMATTR InstName R88
SYMATTR Value 100k
SYMBOL nmos 7440 928 R0
SYMATTR InstName M2
SYMBOL res 7184 1008 R0
SYMATTR InstName R89
SYMATTR Value 100k
SYMBOL res 7344 880 R90
WINDOW 0 0 56 VBottom 2
WINDOW 3 32 56 VTop 2
SYMATTR InstName R90
SYMATTR Value 100k
SYMBOL res 7680 1104 R0
SYMATTR InstName R91
SYMATTR Value 10k
SYMBOL res 7680 1216 R0
SYMATTR InstName R92
SYMATTR Value 10k
SYMBOL res 7776 1200 R0
SYMATTR InstName R93
SYMATTR Value 100k
SYMBOL Opamps\\UniversalOpamp2 6528 2160 R0
SYMATTR InstName U19
SYMBOL res 6368 2240 R0
SYMATTR InstName R64
SYMATTR Value 100k
SYMBOL res 6288 2240 R0
SYMATTR InstName R65
SYMATTR Value 100k
SYMBOL diode 6368 2128 R0
SYMATTR InstName D3
SYMATTR Value 1N914
SYMBOL diode 6464 2208 R180
WINDOW 0 24 64 Left 2
WINDOW 3 24 0 Left 2
SYMATTR InstName D4
SYMATTR Value 1N914
SYMBOL Opamps\\UniversalOpamp2 6832 2304 R0
SYMATTR InstName U20
SYMBOL cap 6736 2304 R90
WINDOW 0 0 32 VBottom 2
WINDOW 3 32 32 VTop 2
SYMATTR InstName C4
SYMATTR Value 500p
SYMBOL res 6736 2304 R0
SYMATTR InstName R66
SYMATTR Value 100k
SYMBOL res 6896 2160 R90
WINDOW 0 0 56 VBottom 2
WINDOW 3 32 56 VTop 2
SYMATTR InstName R94
SYMATTR Value 100k
SYMBOL res 6784 2192 R180
WINDOW 0 36 76 Left 2
WINDOW 3 36 40 Left 2
SYMATTR InstName R95
SYMATTR Value 100k
SYMBOL nmos 7168 2368 R0
SYMATTR InstName M3
SYMBOL res 7200 2512 R0
SYMATTR InstName R96
SYMATTR Value 100k
SYMBOL Opamps\\UniversalOpamp2 7216 2160 R0
SYMATTR InstName U24
SYMBOL res 7408 2224 R0
SYMATTR InstName R97
SYMATTR Value 100k
SYMBOL nmos 7376 2080 R0
SYMATTR InstName M4
SYMBOL res 7120 2160 R0
SYMATTR InstName R98
SYMATTR Value 100k
SYMBOL res 7280 2032 R90
WINDOW 0 0 56 VBottom 2
WINDOW 3 32 56 VTop 2
SYMATTR InstName R99
SYMATTR Value 100k
SYMBOL res 7616 2256 R0
SYMATTR InstName R100
SYMATTR Value 10k
SYMBOL res 7616 2368 R0
SYMATTR InstName R101
SYMATTR Value 10k
SYMBOL res 7712 2352 R0
SYMATTR InstName R102
SYMATTR Value 100k
SYMBOL voltage 2240 144 R0
WINDOW 123 24 124 Left 2
WINDOW 39 0 0 Left 2
SYMATTR Value2 AC 1
SYMATTR InstName V3
SYMATTR Value SINE(2.5 2.5 100)
TEXT 1560 -112 Left 2 !.tran 0 0.5s 0 10u
TEXT 3072 -304 Left 2 ;Weapon_collider = Player_Position + 0.1*Weapon_Position - 0.5*Weapon_Position_Max
TEXT 3504 -376 Left 2 ;Summing Amplifier
TEXT 6128 368 Left 2 ;Collision Detection
TEXT 6048 688 Left 2 ;Weapon Player 1 against Player 2
TEXT 6096 1816 Left 2 ;Weapon Player 2 against Player 1
TEXT 5864 1864 Left 2 ;No difference between x and y coordinates of player 2 weapon and player 1 position
TEXT 5864 1896 Left 2 ;makes collision detection go high to supply voltage.
TEXT 5976 760 Left 2 ;makes collision detection go high to supply voltage.
TEXT 5832 728 Left 2 ;No difference between x and y coordinates of player 1 weapon and player 2 position

The netlist it stands for:
* analog-vg-circuit-stabber.asc
R3 N004 N005 100k
XU2 N004 N003 VCC VEE Vout_w1cox level.2 Avol=1Meg GBW=10Meg Slew=10Meg ilimit=25m rail=0 Vos=0 phimargin=45 en=0 enk=0 in=0 ink=0 Rin=500Meg  ; pins IN+ IN- V+ V- OUT
V2 VEE 0 -5 AC 1
R16 N002 0 50k
R17 N001 N002 50k
R18 W1posx 0 50k
R19 VCC W1posx 50k
V1 VCC 0 5 AC 1
XU1 N007 N006 VCC VEE N006 level.2 Avol=1Meg GBW=10Meg Slew=10Meg ilimit=25m rail=0 Vos=0 phimargin=45 en=0 enk=0 in=0 ink=0 Rin=500Meg  ; pins IN+ IN- V+ V- OUT
R7 VEE N005 100k
R8 N005 0 5k
R2 N004 P1posx_buff 100k
R4 Vout_w1cox N003 100k
R5 0 N003 50k
XU3 P1posx P1posx_buff VCC VEE P1posx_buff level.2 Avol=1Meg GBW=10Meg Slew=10Meg ilimit=25m rail=0 Vos=0 phimargin=45 en=0 enk=0 in=0 ink=0 Rin=500Meg  ; pins IN+ IN- V+ V- OUT
C1 N005 0 1µ
R6 N007 0 10k
R9 N007 W1posx 100k
C3 N005 0 1p
R1 N004 N006 100k
R10 P1posy 0 50k
R11 VCC P1posy 50k
R12 W1posy 0 50k
R13 VCC W1posy 50k
R14 N017 N022 100k
XU4 N017 N015 VCC VEE Vout_w1coy level.2 Avol=1Meg GBW=10Meg Slew=10Meg ilimit=25m rail=0 Vos=0 phimargin=45 en=0 enk=0 in=0 ink=0 Rin=500Meg  ; pins IN+ IN- V+ V- OUT
XU5 N028 N026 VCC VEE N026 level.2 Avol=1Meg GBW=10Meg Slew=10Meg ilimit=25m rail=0 Vos=0 phimargin=45 en=0 enk=0 in=0 ink=0 Rin=500Meg  ; pins IN+ IN- V+ V- OUT
R15 VEE N022 100k
R20 N022 0 5k
R21 N017 P1posy_buff 100k
R22 Vout_w1coy N015 100k
R23 0 N015 50k
R24 N028 0 10k
R25 N028 W1posy 100k
R26 N017 N026 100k
R27 P2posx N045 50k
R28 VCC P2posx 50k
R29 W2posx 0 50k
R30 VCC W2posx 50k
R31 N032 N038 100k
XU7 N032 N031 VCC VEE Vout_w2cox level.2 Avol=1Meg GBW=10Meg Slew=10Meg ilimit=25m rail=0 Vos=0 phimargin=45 en=0 enk=0 in=0 ink=0 Rin=500Meg  ; pins IN+ IN- V+ V- OUT
XU8 N047 N043 VCC VEE N043 level.2 Avol=1Meg GBW=10Meg Slew=10Meg ilimit=25m rail=0 Vos=0 phimargin=45 en=0 enk=0 in=0 ink=0 Rin=500Meg  ; pins IN+ IN- V+ V- OUT
R32 VEE N038 100k
R33 N038 0 5k
R34 N032 P2posx_buff 100k
R35 Vout_w2cox N031 100k
R36 0 N031 50k
XU9 P2posx P2posx_buff VCC VEE P2posx_buff level.2 Avol=1Meg GBW=10Meg Slew=10Meg ilimit=25m rail=0 Vos=0 phimargin=45 en=0 enk=0 in=0 ink=0 Rin=500Meg  ; pins IN+ IN- V+ V- OUT
C5 N038 0 1µ
R37 N047 0 10k
R38 N047 W2posx 100k
C6 N038 0 1p
R39 N032 N043 100k
R40 P2posy 0 50k
R41 VCC P2posy 50k
R42 W2posy 0 50k
R43 VCC W2posy 50k
R44 N052 N053 100k
XU10 N052 N051 VCC VEE Vout_w2coy level.2 Avol=1Meg GBW=10Meg Slew=10Meg ilimit=25m rail=0 Vos=0 phimargin=45 en=0 enk=0 in=0 ink=0 Rin=500Meg  ; pins IN+ IN- V+ V- OUT
XU11 N055 N054 VCC VEE N054 level.2 Avol=1Meg GBW=10Meg Slew=10Meg ilimit=25m rail=0 Vos=0 phimargin=45 en=0 enk=0 in=0 ink=0 Rin=500Meg  ; pins IN+ IN- V+ V- OUT
R45 VEE N053 100k
R46 N053 0 5k
R47 N052 P2posy_buff 100k
R48 Vout_w2coy N051 100k
R49 0 N051 50k
XU12 P2posy P2posy_buff VCC VEE P2posy_buff level.2 Avol=1Meg GBW=10Meg Slew=10Meg ilimit=25m rail=0 Vos=0 phimargin=45 en=0 enk=0 in=0 ink=0 Rin=500Meg  ; pins IN+ IN- V+ V- OUT
C7 N053 0 1µ
R50 N055 0 10k
R51 N055 W2posy 100k
C8 N053 0 1p
R52 N052 N054 100k
XU13 N021 N010 VCC VEE N011 level.2 Avol=1Meg GBW=10Meg Slew=10Meg ilimit=25m rail=0 Vos=0 phimargin=45 en=0 enk=0 in=0 ink=0 Rin=500Meg  ; pins IN+ IN- V+ V- OUT
R53 N011 N010 100k
R54 N021 0 100k
XU16 N012 N008 VCC VEE N009 level.2 Avol=1Meg GBW=10Meg Slew=10Meg ilimit=25m rail=0 Vos=0 phimargin=45 en=0 enk=0 in=0 ink=0 Rin=500Meg  ; pins IN+ IN- V+ V- OUT
R58 N009 N008 100k
R59 N012 0 100k
XU17 P1posy P1posy_buff VCC VEE P1posy_buff level.2 Avol=1Meg GBW=10Meg Slew=10Meg ilimit=25m rail=0 Vos=0 phimargin=45 en=0 enk=0 in=0 ink=0 Rin=500Meg  ; pins IN+ IN- V+ V- OUT
XU6 N027 N025 VCC VEE N023 level.2 Avol=1Meg GBW=10Meg Slew=10Meg ilimit=25m rail=0 Vos=0 phimargin=45 en=0 enk=0 in=0 ink=0 Rin=500Meg  ; pins IN+ IN- V+ V- OUT
R60 N023 N025 100k
R61 N027 0 100k
XU18 N044 N033 VCC VEE N034 level.2 Avol=1Meg GBW=10Meg Slew=10Meg ilimit=25m rail=0 Vos=0 phimargin=45 en=0 enk=0 in=0 ink=0 Rin=500Meg  ; pins IN+ IN- V+ V- OUT
R62 N034 N033 100k
R63 N044 0 100k
XU21 N035 N029 VCC VEE N030 level.2 Avol=1Meg GBW=10Meg Slew=10Meg ilimit=25m rail=0 Vos=0 phimargin=45 en=0 enk=0 in=0 ink=0 Rin=500Meg  ; pins IN+ IN- V+ V- OUT
R67 N030 N029 100k
R68 N035 0 100k
XU22 N050 N049 VCC VEE N046 level.2 Avol=1Meg GBW=10Meg Slew=10Meg ilimit=25m rail=0 Vos=0 phimargin=45 en=0 enk=0 in=0 ink=0 Rin=500Meg  ; pins IN+ IN- V+ V- OUT
R69 N046 N049 100k
R70 N050 0 100k
R71 N010 N009 100k
R72 N021 N023 100k
R73 N008 Vout_w1cox 100k
R74 N012 P2posx_buff 100k
R75 N025 Vout_w1coy 100k
R76 N027 P2posy_buff 100k
R77 N029 Vout_w2cox 100k
R78 N035 P1posx_buff 100k
R79 N033 N030 100k
R80 N044 N046 100k
R81 N049 Vout_w2coy 100k
R82 N050 P1posy_buff 100k
R83 VCC N001 10k
R84 N045 0 10k
XU14 N018 N016 VCC VEE zero_detect_W1P2 level.2 Avol=1Meg GBW=10Meg Slew=10Meg ilimit=25m rail=0 Vos=0 phimargin=45 en=0 enk=0 in=0 ink=0 Rin=500Meg  ; pins IN+ IN- V+ V- OUT
R55 N018 N011 100k
R56 N016 0 100k
D1 N016 N018 1N914
D2 N018 N016 1N914
XU15 N024 N019 VCC VEE N020 level.2 Avol=1Meg GBW=10Meg Slew=10Meg ilimit=25m rail=0 Vos=0 phimargin=45 en=0 enk=0 in=0 ink=0 Rin=500Meg  ; pins IN+ IN- V+ V- OUT
C2 N024 zero_detect_W1P2 500p
R57 N024 0 100k
R85 N020 N019 100k
R86 N019 0 100k
M1 VCC N020 Collision_detect_pos_W1P2 Collision_detect_pos_W1P2 NMOS
R87 Collision_detect_pos_W1P2 0 100k
XU23 0 N013 VCC VEE N014 level.2 Avol=1Meg GBW=10Meg Slew=10Meg ilimit=25m rail=0 Vos=0 phimargin=45 en=0 enk=0 in=0 ink=0 Rin=500Meg  ; pins IN+ IN- V+ V- OUT
R88 Collision_detect_neg_W1P2 0 100k
M2 VCC N014 Collision_detect_neg_W1P2 Collision_detect_neg_W1P2 NMOS
R89 N013 N020 100k
R90 N014 N013 100k
R91 Collision_detect_neg_W1P2 collision_detect_W1P2 10k
R92 collision_detect_W1P2 Collision_detect_pos_W1P2 10k
R93 collision_detect_W1P2 0 100k
XU19 N040 N039 VCC VEE zero_detect_W2P1 level.2 Avol=1Meg GBW=10Meg Slew=10Meg ilimit=25m rail=0 Vos=0 phimargin=45 en=0 enk=0 in=0 ink=0 Rin=500Meg  ; pins IN+ IN- V+ V- OUT
R64 N040 N034 100k
R65 N039 0 100k
D3 N039 N040 1N914
D4 N040 N039 1N914
XU20 N048 N041 VCC VEE N042 level.2 Avol=1Meg GBW=10Meg Slew=10Meg ilimit=25m rail=0 Vos=0 phimargin=45 en=0 enk=0 in=0 ink=0 Rin=500Meg  ; pins IN+ IN- V+ V- OUT
C4 N048 zero_detect_W2P1 500p
R66 N048 0 100k
R94 N042 N041 100k
R95 N041 0 100k
M3 VCC N042 Collision_detect_pos_W2P1 Collision_detect_pos_W2P1 NMOS
R96 Collision_detect_pos_W2P1 0 100k
XU24 0 N036 VCC VEE N037 level.2 Avol=1Meg GBW=10Meg Slew=10Meg ilimit=25m rail=0 Vos=0 phimargin=45 en=0 enk=0 in=0 ink=0 Rin=500Meg  ; pins IN+ IN- V+ V- OUT
R97 Collision_detect_neg_W2P1 0 100k
M4 VCC N037 Collision_detect_neg_W2P1 Collision_detect_neg_W2P1 NMOS
R98 N036 N042 100k
R99 N037 N036 100k
R100 Collision_detect_neg_W2P1 collision_detect_W2P1 10k
R101 collision_detect_W2P1 Collision_detect_pos_W2P1 10k
R102 collision_detect_W2P1 0 100k
V3 P1posx 0 SINE(2.5 2.5 100) AC 1
.model D D
.lib standard.dio
.model NMOS NMOS
.model PMOS PMOS
.lib standard.mos
.tran 0 0.5s 0 10u
* Weapon_collider = Player_Position + 0.1*Weapon_Position - 0.5*Weapon_Position_Max
* Summing Amplifier
* Collision Detection
* Weapon Player 1 against Player 2
* Weapon Player 2 against Player 1
* No difference between x and y coordinates of player 2 weapon and player 1 position
* makes collision detection go high to supply voltage.
* makes collision detection go high to supply voltage.
* No difference between x and y coordinates of player 1 weapon and player 2 position
.lib UniversalOpamps2.sub
.backanno
.end